# Altium schematic sheet 屏幕.schdoc
size 267 x 156 mm
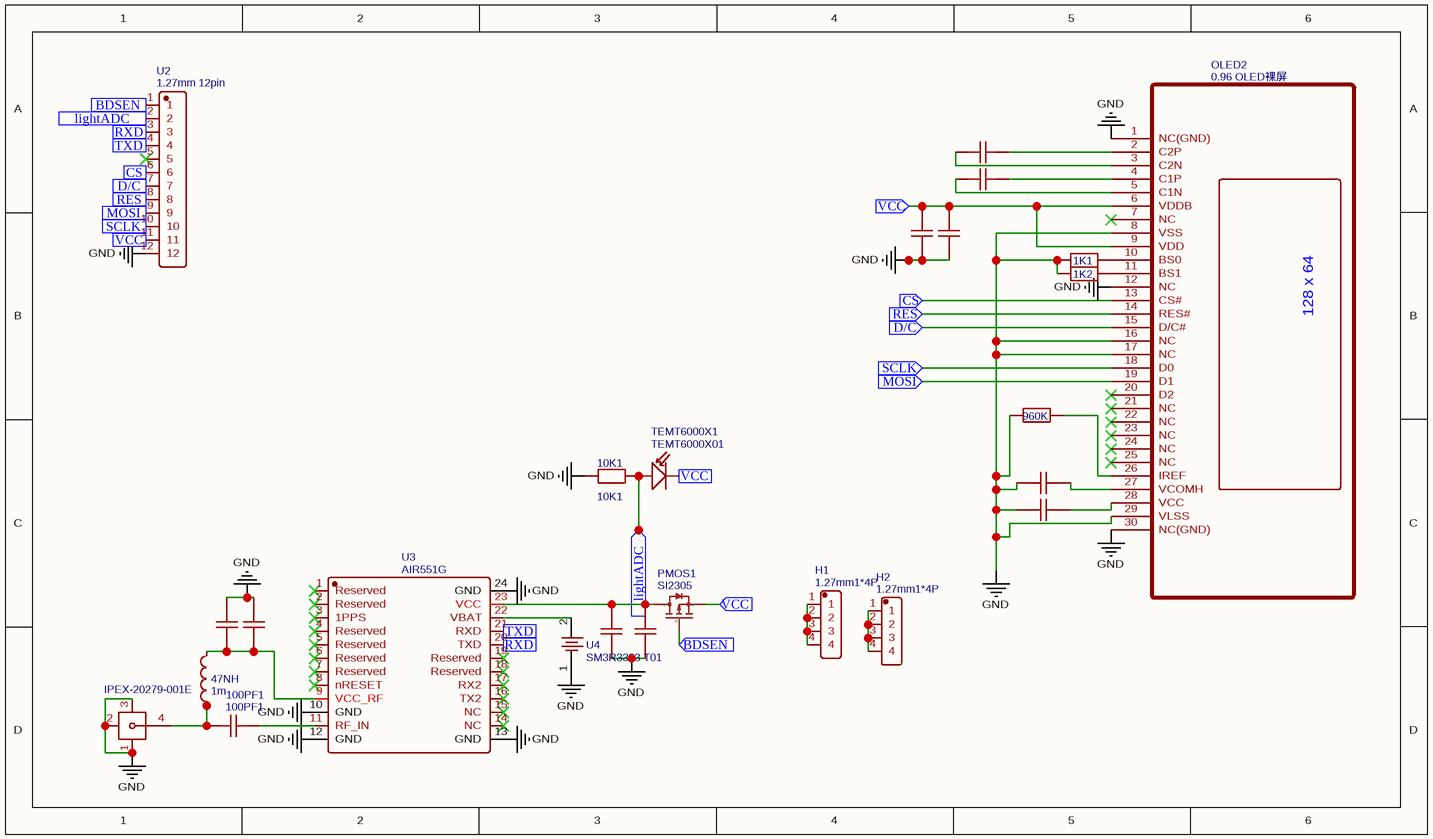
[diagram p0: 屏幕.schdoc]

## Parts
1K1  1k  [R0603]  (value not drawn)
1K2  1k  [R0603]  (value not drawn)
1U3  1U  [C0603]  (value not drawn)
1U4  1u  [C0603]  (value not drawn)
1U5  1u  [C0603]  (value not drawn)
1U6  1U  [C0603]  (value not drawn)
2.1UF  0.1u  [C0603]  (value not drawn)
2.2UF  0.1u  [C0603]  (value not drawn)
2.3UF  0.1u  [C0603]  (value not drawn)
4.7U1  0.1u  [C0603]  (value not drawn)
4.7U2  0.1u  [C0603]  (value not drawn)
4.7U3  0.1u  [C0603]  (value not drawn)
10K1  10K1  [R0603]
47NH  1m  [L0603]
100PF1  100PF1  [C0603]
960K  1k  [R0603]  (value not drawn)
H1  1.27mm1*4P  [1.27MM1*4P]
H2  1.27mm1*4P  [1.27MM1*4P]
NO  IPEX-20279-001E  [IPEX-SMD_4P-L2.6-W2.6-LS3.0]
OLED2  0.96 OLED裸屏  [OLED-12864-0.96-30PIN]
PMOS1  SI2305  [SOT-23-3_L2.9-W1.3-P1.90-LS2.4-BR]
TEMT6000X1  TEMT6000X01  [SENSORS-SMD_TEMT6000X01]
U2  1.27mm 12pin  [1.27MM 12P]
U3  AIR551G  [GPS-SMD_24P-L16.0-W12.2-P1.10]
U4  SM3R3333 T01  [BAT-SMD_SM3R3333-T01]

## Ports
BDSEN (in), CS (in), D/C (in), lightADC (in), MOSI (in), RES (in), RXD (in), SCLK (in), TXD (in), VCC (in)

## Nets
GND: 1K1.1 1K2.1 1U5.1 1U6.1 2.1UF.2 2.2UF.1 2.3UF.1 4.7U1.2 4.7U2.1 4.7U3.1 10K1.1 960K.1 NO.1 NO.2 NO.3 OLED2.1(NC(GND)) OLED2.8(VSS) OLED2.12(NC) OLED2.16(NC) OLED2.17(NC) OLED2.29(VLSS) OLED2.30(NC(GND)) U2.12 U3.10(GND) U3.12(GND) U3.13(GND) U3.24(GND) U4.1
BDSEN: PMOS1.1(G) U2.1 ; port BDSEN
CS: OLED2.13(CS#) U2.6 ; port CS
D/C: OLED2.15(D/C#) U2.7 ; port D/C
lightADC: 10K1.2 TEMT6000X1.1(+) TEMT6000X1.2(+) U2.2 ; port lightADC
MOSI: OLED2.19(D1) U2.9 ; port MOSI
RES: OLED2.14(RES#) U2.8 ; port RES
RXD: U2.3 U3.20(TXD) ; port RXD
SCLK: OLED2.18(D0) U2.10 ; port SCLK
TXD: U2.4 U3.21(RXD) ; port TXD
VCC: 1U5.2 1U6.2 OLED2.6(VDDB) OLED2.9(VDD) PMOS1.2(S) TEMT6000X1.3(-) U2.11 ; port VCC
Net1K1_2: 1K1.2 OLED2.10(BS0)
Net1K2_2: 1K2.2 OLED2.11(BS1)
Net1U3_1: 1U3.1 OLED2.5(C1N)
Net1U3_2: 1U3.2 OLED2.4(C1P)
Net1U4_1: 1U4.1 OLED2.3(C2N)
Net1U4_2: 1U4.2 OLED2.2(C2P)
Net2.1UF_1: 2.1UF.1 4.7U1.1 47NH.2 U3.9(VCC_RF)
Net2.2UF_2: 2.2UF.2 OLED2.28(VCC)
Net2.3UF_2: 2.3UF.2 4.7U3.2 PMOS1.3(D) U3.23(VCC)
Net4.7U2_2: 4.7U2.2 OLED2.27(VCOMH)
Net47NH_1: 47NH.1 100PF1.1 NO.4
Net100PF1_2: 100PF1.2 U3.11(RF_IN)
Net960K_2: 960K.2 OLED2.26(IREF)
NetH1_1: H1.1 H1.2 H1.3 H1.4
NetH2_1: H2.1 H2.2 H2.3 H2.4
NetU3_22: U3.22(VBAT) U4.2

Not connected (* = marked no-connect by the designer): OLED2 7(NC)* 20(D2)* 21(NC)* 22(NC)* 23(NC)* 24(NC)* 25(NC)*; U2 5*; U3 1(Reserved)* 2(Reserved)* 3(1PPS)* 4(Reserved)* 5(Reserved)* 6(Reserved)* 7(Reserved)* 8(nRESET)* 14(NC)* 15(NC)* 16(TX2)* 17(RX2)* 18(Reserved)* 19(Reserved)*

## Notes on the sheet
- (in symbol 0.96 OLED裸屏) 128 x 64

## Library data of the parts
1K1 1K2 960K = 1k: nameAlias: Value(Ω); Contributor: LCEDA_Lib; spicePre: R; spiceSymbolName: R_0603_EU
1U3 1U6 = 1U: nameAlias: Value(F); Contributor: LCEDA_Lib; spicePre: C; spiceSymbolName: C_0603_US
1U4 1U5 = 1u: nameAlias: Value(F); Contributor: LCEDA_Lib; spicePre: C; spiceSymbolName: C_0603_US
2.1UF 2.2UF 2.3UF 4.7U1-4.7U3 = 0.1u: nameAlias: Value(F); Contributor: LCEDA_Lib; spicePre: C; spiceSymbolName: C_0603_US
10K1 = 10K1: nameAlias: Value(Ω); Contributor: LCEDA_Lib; spicePre: R; spiceSymbolName: R_0603_EU
47NH = 1m: nameAlias: Value(H); Contributor: LCEDA_Lib; spicePre: L; spiceSymbolName: L0603_US
100PF1 = 100PF1: nameAlias: Value(F); Contributor: LCEDA_Lib; spicePre: C; spiceSymbolName: C_0603_US
H1 H2 = 1.27mm1*4P: BOM_Manufacturer: ReliaPro; BOM_Manufacturer Part: 1.27mm1*12P Straight Headers  Pins; Contributor: CyTech; BOM_Supplier Part: C28953; BOM_Supplier: LCSC; image: http://image.lceda.cn/szlcsc/C28953.jpg; spicePre: H; spiceSymbolName: 1.27mm1*4P
NO = IPEX-20279-001E: Contributor: LCSC; BOM_Supplier: LCSC; BOM_Supplier Part: C9900004475; BOM_Manufacturer Part: IPEX-20279-001E; BOM_JLCPCB Part Class: Extended Part; spicePre: R; spiceSymbolName: IPEX-20279-001E
OLED2 = 0.96 OLED裸屏: BOM_Manufacturer Part: SSD1315-OLED-12864-0.96; Contributor: ajiu; BOM_Supplier: 中景园/优智景; BOM_Supplier Part: SSD1315-OLED-12864-0.96; BOM_JLCPCB Part Class: Extended Part; spicePre: O; spiceSymbolName: 0.96 OLED裸屏
PMOS1 = SI2305: BOM_Manufacturer: Hottech; Contributor: LCSC; BOM_Supplier: LCSC; BOM_Manufacturer Part: SI2305; BOM_Supplier Part: C181088; BOM_JLCPCB Part Class: Extended Part; spicePre: Q; spiceSymbolName: SI2305
TEMT6000X1 = TEMT6000X01: BOM_Manufacturer: VISHAY; BOM_Supplier: LCSC; BOM_Manufacturer Part: TEMT6000X01; BOM_Supplier Part: C94098; BOM_JLCPCB Part Class: Extended Part; spicePre: U; spiceSymbolName: TEMT6000X01
U2 = 1.27mm 12pin: Contributor: ThunderStorm0411; spicePre: U; spiceSymbolName: 1.27mm 12pin
U3 = AIR551G: BOM_Manufacturer: null; Contributor: LCSC; BOM_Supplier: LCSC; BOM_Supplier Part: C9900011816; BOM_Manufacturer Part: Air551G; BOM_JLCPCB Part Class: Extended Part; spicePre: U; spiceSymbolName: AIR551G
U4 = SM3R3333 T01: BOM_Manufacturer: KORCHIP(高奇普); Capacitance: 33000uF; Contributor: LCSC; BOM_Supplier: LCSC; BOM_Supplier Part: C260765; BOM_Manufacturer Part: SM3R3333 T01; BOM_JLCPCB Part Class: Extended Part; spicePre: U; spiceSymbolName: SM3R3333 T01